# Altium schematic sheet hv_io_connector.SchDoc
size A4; Organization: Badgerloop; Address1: 133 Engineering Research; Address2: Building; Address3: Madison, WI 53715
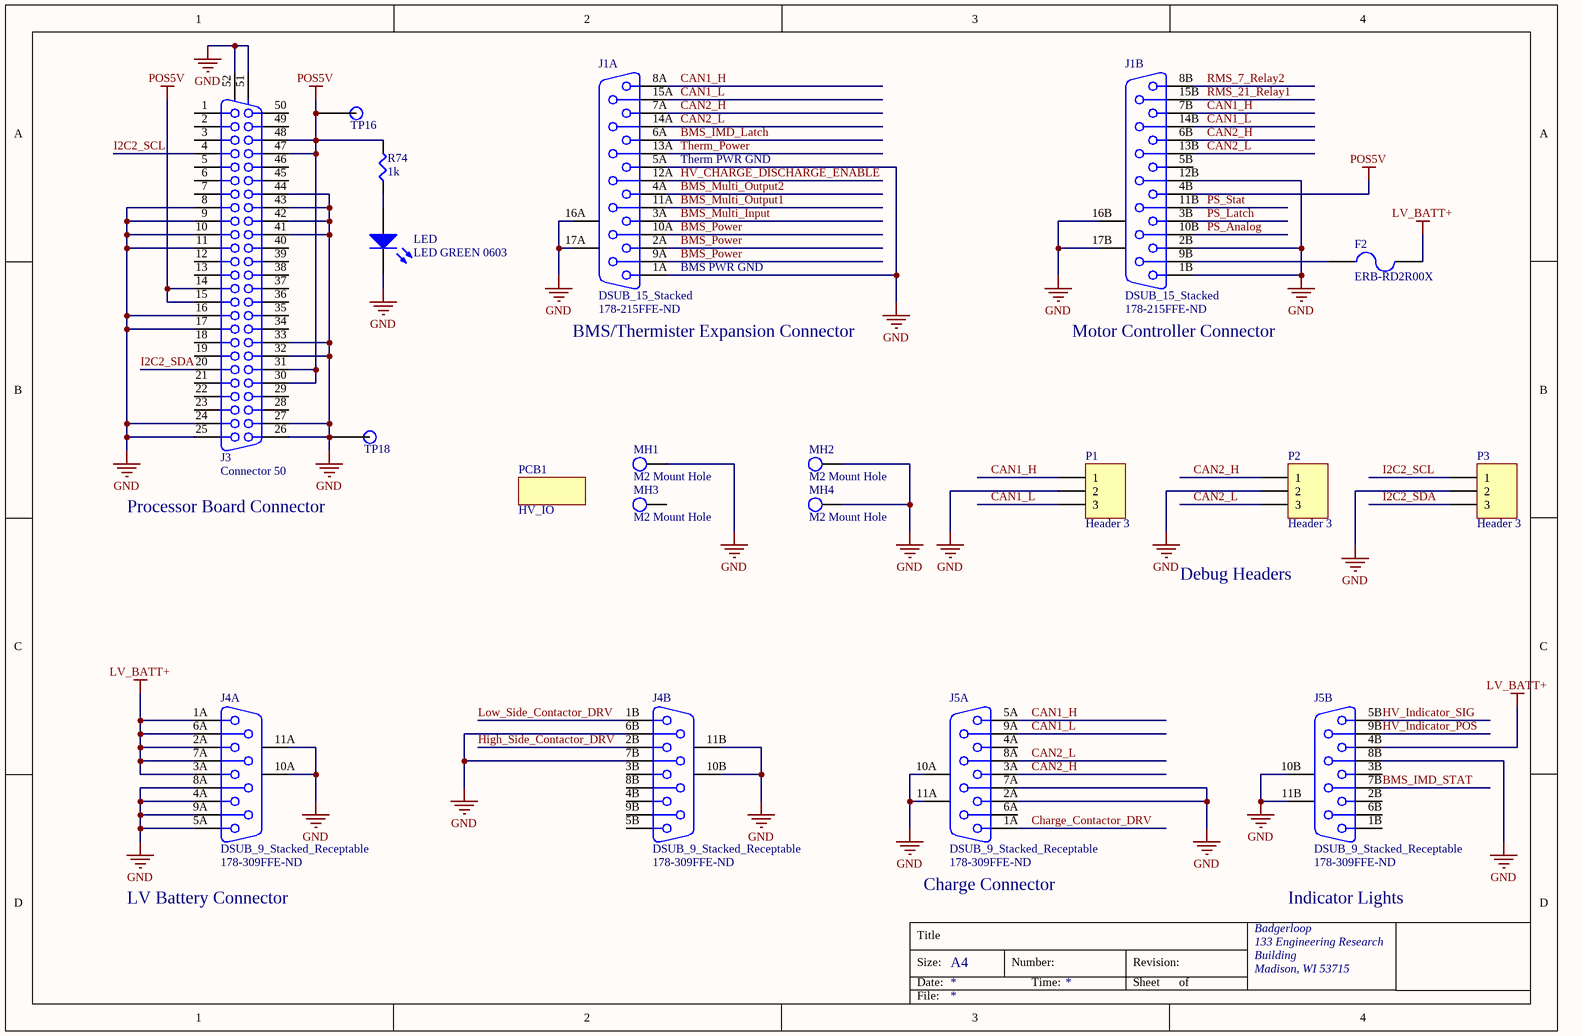
[diagram p0: hv_io_connector.SchDoc]

## Parts
F2  ERB-RD2R00X  [SMD-0402-RES]
J1  DSUB_15_Stacked  Supplier Part Number 1: 178-215FFE-ND  [DSUB_15_Stacked]  (parts A,B of 2)
J3  Connector 50  [050DSUB1.27-H96]
J4  DSUB_9_Stacked_Receptable  Supplier Part Number 1: 178-309FFE-ND  [DSUB_9_Stacked]  (parts A,B of 2)
J5  DSUB_9_Stacked_Receptable  Supplier Part Number 1: 178-309FFE-ND  [DSUB_9_Stacked]  (parts A,B of 2)
LED  LED GREEN 0603  [LED 0603 GREEN]
MH1  M2 Mount Hole  [MH]
MH2  M2 Mount Hole  [MH]
MH3  M2 Mount Hole  [MH]
MH4  M2 Mount Hole  [MH]
P1  Header 3  [Pin Header 1x3 TH Pitch 2.54mm]
P2  Header 3  [Pin Header 1x3 TH Pitch 2.54mm]
P3  Header 3  [Pin Header 1x3 TH Pitch 2.54mm]
PCB1  HV_IO  [PCB]
R74  1k  [SMD-0805-RES]
TP16  TP  [Test Point]  (value not drawn)
TP18  TP  [Test Point]  (value not drawn)

## Nets
GND: J1.1A J1.1B J1.2B J1.5A J1.12B J1.16A(MH1) J1.16B(MH1) J1.17A(MH2) J1.17B(MH2) J3.8 J3.9 J3.10 J3.11 J3.16 J3.17 J3.24 J3.25 J3.26 J3.27 J3.32 J3.33 J3.41 J3.42 J3.43 J3.44 J3.51 J3.52 J4.4A J4.5A J4.6B J4.7B J4.8A J4.9A J4.10A(MH1) J4.10B(MH1) J4.11A(MH2) J4.11B(MH2) J5.2A J5.7A J5.8B J5.10A(MH1) J5.10B(MH1) J5.11A(MH2) J5.11B(MH2) LED.2(K) MH1.1 MH2.1 MH4.1 P1.2 P2.2 P3.2 TP18.1
LV_BATT+: F2.2 J4.1A J4.2A J4.3A J4.6A J4.7A J5.4B
POS5V: J1.4B J3.14 J3.15 J3.30 J3.31 J3.47 J3.48 R74.2 TP16.1
BMS_IMD_Latch: J1.6A
BMS_IMD_STAT: J5.7B
BMS_Multi_Input: J1.3A
BMS_Multi_Output1: J1.11A
BMS_Multi_Output2: J1.4A
BMS_Power: J1.2A J1.9A J1.10A
CAN1_H: J1.7B J1.8A J5.5A P1.1
CAN1_L: J1.14B J1.15A J5.9A P1.3
CAN2_H: J1.6B J1.7A J5.3A P2.1
CAN2_L: J1.13B J1.14A J5.8A P2.3
Charge_Contactor_DRV: J5.1A
High_Side_Contactor_DRV: J4.2B
HV_CHARGE_DISCHARGE_ENABLE: J1.12A
HV_Indicator_POS: J5.9B
HV_Indicator_SIG: J5.5B
I2C2_SCL: J3.4 P3.1
I2C2_SDA: J3.20 P3.3
Low_Side_Contactor_DRV: J4.1B
PS_Analog: J1.10B
PS_Latch: J1.3B
PS_Stat: J1.11B
RMS_7_Relay2: J1.8B
RMS_21_Relay1: J1.15B
Therm_Power: J1.13A
NetF2_1: F2.1 J1.9B
NetLED_1: LED.1(A) R74.1

Not connected (* = marked no-connect by the designer): J1 5B(5); J3 1 2 3 5 6 7 12 13 18 19 21 22 23 28 29 34 35 36 37 38 39 40 45 46 49 50; J4 3B(3) 4B(4) 5B(5) 8B(8) 9B(9); J5 1B(1) 2B(2) 3B(3) 4A(4) 6A(6) 6B(6); MH3 1

## Notes on the sheet
- (near J1) Therm PWR GND
- (near J1) BMS PWR GND
- (near J1) BMS/Thermister Expansion Connector
- (near J1) Motor Controller Connector
- Processor Board Connector
- Debug Headers
- LV Battery Connector
- (near J5) Charge Connector
- Indicator Lights
- Title
- Size:
- Date:
- A4
- Number:
- Time:
- Revision:
- Sheet
- of
- File:

## Library data of the parts
F2 = ERB-RD2R00X: FUSE BOARD MOUNT 2A 32VDC 0402; Manufacturer: Panasonic; Manufacturer P/N: ERB-RD2R00X; Digikey P/N: P15123TR-ND; Digikey Link: https://www.digikey.com/product-detail/en/panasonic-electronic-components/ERB-RD2R00X/P15123TR-ND/2796785
J1 = DSUB_15_Stacked: CONN D-SUB RCPT 15POS R/A SLDR; pin to pad: 1>16 1A>1 1B>16 2>17 2A>2 2B>17 3>18 3A>3 3B>18 4>19 4A>4 4B>19 5>20 5A>5 5B>20 6>21 6A>6 6B>21 7>22 7A>7 7B>22 8>23 8A>8 8B>23 9>24 9A>9 9B>24 10>25 10A>10 10B>25 11>26 11A>11 11B>26 12>27 12A>12 12B>27 13>28 13A>13 13B>28 14>29 14A>14 14B>29 15>30 15A>15 15B>30 16>31 16A>32 16B>34 17>32 17A>31 17B>33; Manufacturer: NorComp; Manufacturer Part Number: 178-015-513R491; Body Material: Steel; Current Rating: 5A; Connector Type: D-Sub,Receptacle,Signal; Number of Contacts: 30; Gender: Female; Supplier 1: Digi-Key; RoHS: Yes; Stock 1: 2348; Pricing 1: 1 = 8.81000, 10 = 8.42600, 35 = 7.66000, 70 = 7.27700, 105 = 7.08552, 280 = 6.31950, 525 = 5.93650, 1015 = 5.24710 (USD); Mount: Edge,Through Hole; Color: Black; Contact Plating: Gold; Contact Material: Brass; Housing Material: Nylon; Min Operating Temperature: -55°C; Max Operating Temperature: 105°C; Package Quantity: 35; Packaging: Tray; Termination: Solder; Features: Shielded; REACH SVHC: No SVHC; Lead Free: Lead Free; ComponentLink1URL: https://www.norcomp.net/rohspdfs/Connectors/17Y/178/513/178-YYY-513R491.pdf; ComponentLink1Description: https://www.norcomp.net/rohspdfs/Connectors/17Y/178/513/178-YYY-513R491.pdf; ComponentLink2URL: http://www.norcomp.net/rohspdfs/Connectors/17Y/178/513/178-YYY-513R491.pdf; ComponentLink2Description: http://www.norcomp.net/rohspdfs/Connectors/17Y/178/513/178-YYY-513R491.pdf
J3 = Connector 50: Plug Header Assembly; Manufacturer: HARTING; Manufacturer P/N: 09665627811; Digikey Link: https://www.digikey.com/product-detail/en/harting/09665627811/1195-5057-ND/4322749; Digikey P/N: 1195-5057-ND
J4 J5 = DSUB_9_Stacked_Receptable: CONN D-SUB RCPT 9POS R/A SLDR; pin to pad: 1>10 1A>1 1B>10 2>11 2A>2 2B>11 3>12 3A>3 3B>12 4>13 4A>4 4B>13 5>14 5A>5 5B>14 6>15 6A>6 6B>15 7>16 7A>7 7B>16 8>17 8A>8 8B>17 9>18 9A>9 9B>18 10>22 10A>20 10B>22 11>21 11A>19 11B>21; Manufacturer: NorComp; Manufacturer Part Number: 178-009-513R691; Plating: Nickel; Gender: Female to Female; Current Rating: 5A; Connector Type: D-Sub,Receptacle,Signal; Number of Contacts: 9; Number of Ports: 2; Supplier 1: Digi-Key; RoHS: Yes; Stock 1: 1545; Pricing 1: 1 = 7.32000, 10 = 7.01500, 45 = 6.40511, 90 = 6.10000, 135 = 5.79504, 270 = 5.18500, 540 = 4.88000, 1035 = 4.27000 (USD); Mount: Edge,Through Hole; Contact Material: Brass; Contact Plating: Gold; Color: Black; Shell Material: Steel; Housing Material: Nylon; Min Operating Temperature: -55°C; Max Operating Temperature: 105°C; Package Quantity: 45; Packaging: Tray; Termination: Solder; Features: Shielded; Lead Free: Lead Free; ComponentLink1URL: http://www.norcomp.net/rohspdfs/Connectors/17Y/178/513/178-YYY-513R691.pdf; ComponentLink1Description: http://www.norcomp.net/rohspdfs/Connectors/17Y/178/513/178-YYY-513R691.pdf
LED = LED GREEN 0603: Manufacturer: Lite-On Inc.; Manufacturer P/N: LTST-C190KGKT; Digikey P/N: 160-1435-1-ND; Package / Case: 0603; Color: GREEN
P1-P3 = Header 3: Header, 3-Pin; LatestRevisionDate: 17-Jul-2002; LatestRevisionNote: Re-released for DXP Platform.; Publisher: Altium Limited
PCB1 = PCB
R74 = ERJ-P06J102V: RES SMD 1K OHM 5% 1/2W 0805; Manufacturer: Panasonic Electronic Components; Factory Stock: 0; Unit Price (USD): 0.01839; @ qty: 1500; Minimum Quantity: 1; Power (Watts): 0.5W, 1/2W; Temperature Coefficient: ±200ppm/°C; Part Number: ERJ-P06J102V; Datasheets: https://industrial.panasonic.com/cdbs/www-data/pdf/RDA0000/AOA0000C243.pdf; Image: //media.digikey.com/Renders/Panasonic%20Renders/ERJ-0805%20Pkg.jpg; Digi-Key Part Number: P1.0KADCT-ND; Quantity Available: 124757; Packaging: Cut Tape (CT); Series: ERJ; Part Status: Active; Value: 1k; Tolerance: ±5%; Composition: Thick Film; Features: Automotive AEC-Q200, Pulse Withstanding; Operating Temperature: -55°C ~ 155°C; Package / Case: 0805 (2012 Metric); Supplier Device Package: 0805; Size / Dimension: 0.079" L x 0.049" W (2.00mm x 1.25mm); Height - Seated (Max): 0.028" (0.70mm); Number of Terminations: 2; Failure Rate: -; Digikey P/N: ERJ-P06J102V